# EAGLE design MT-DS v1 (EAGLE 6.1)
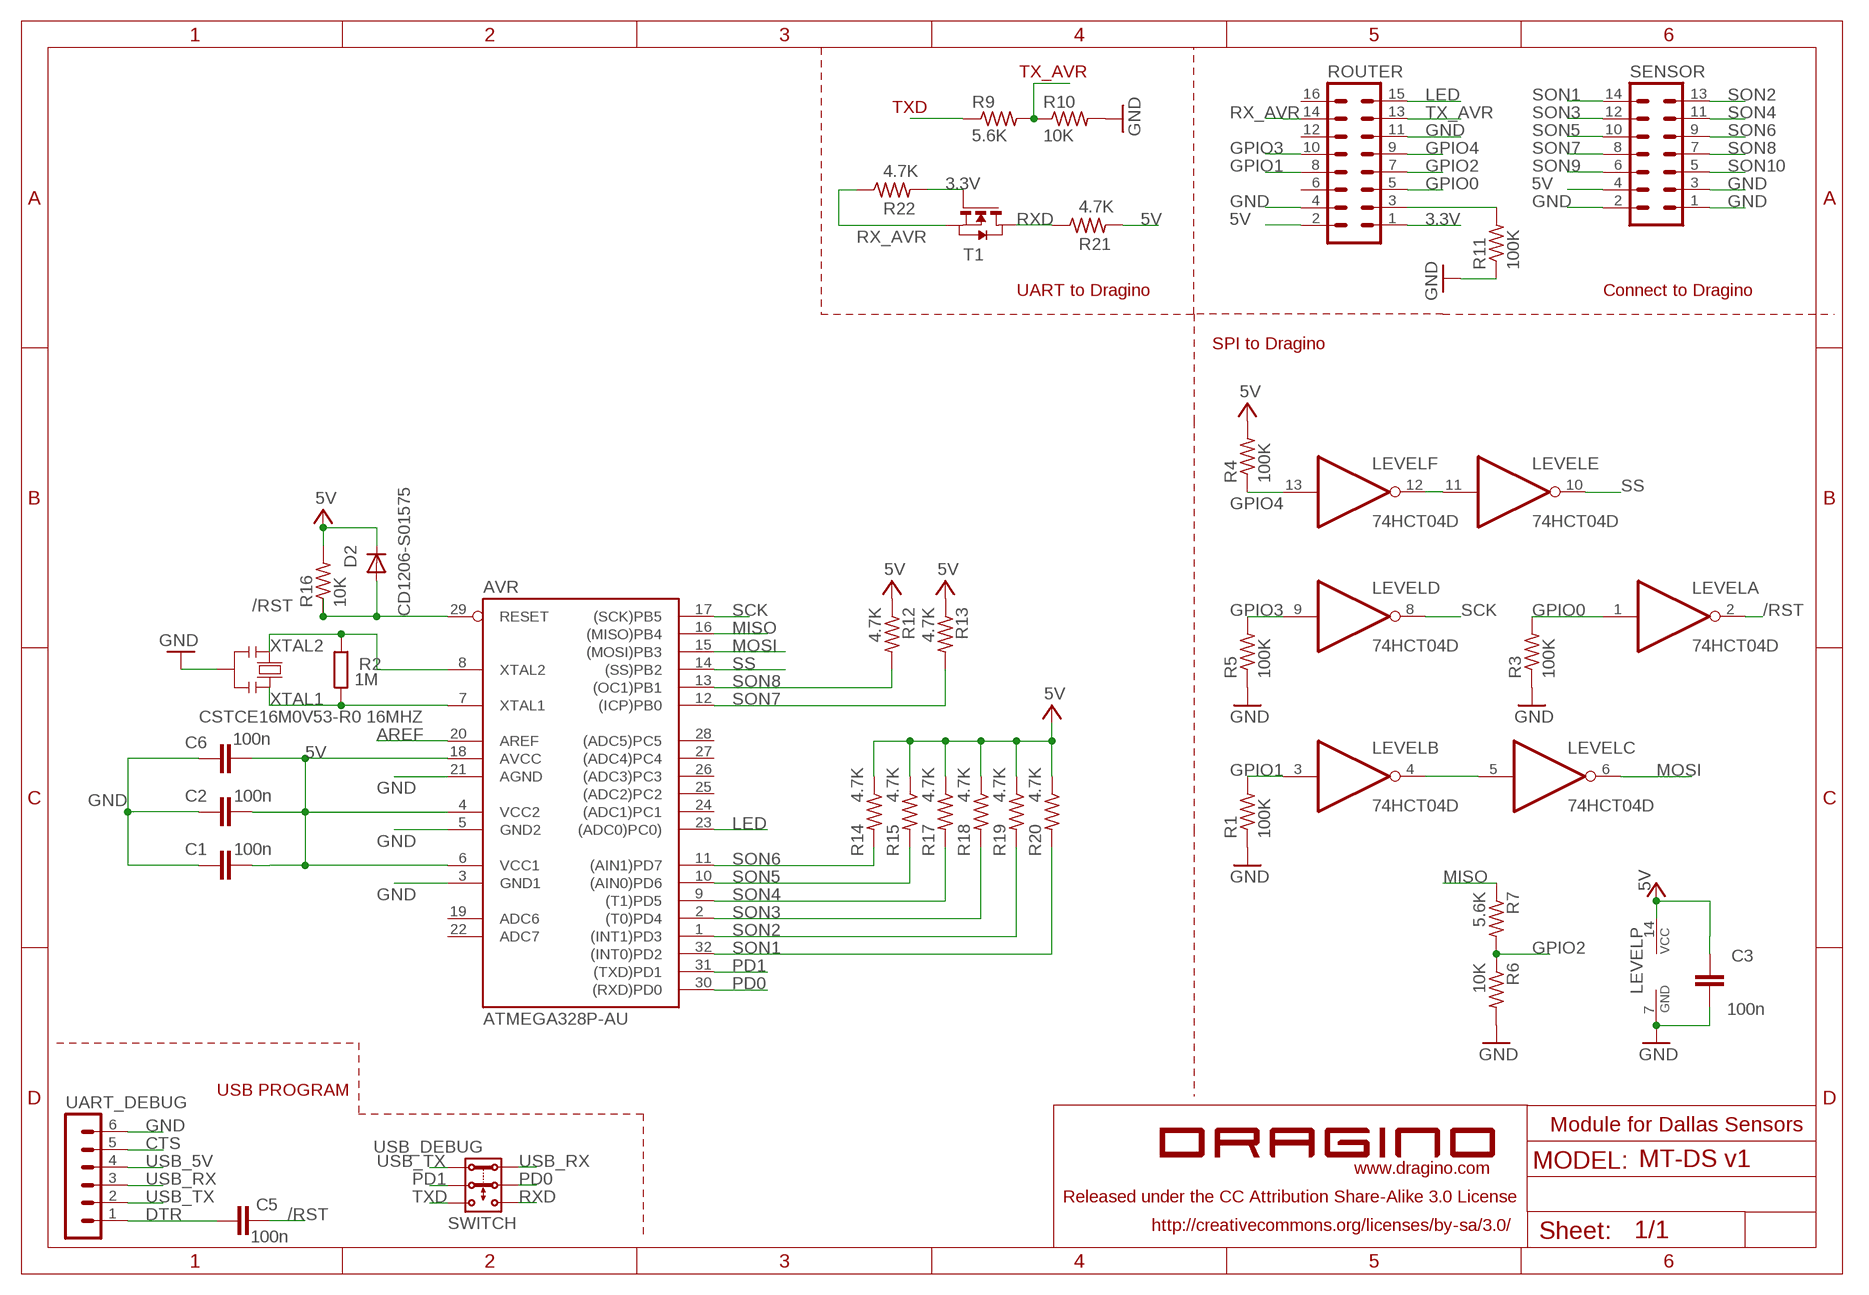
[diagram p0: schematic, sheet 1]

## Parts
AVR  ATMEGA328P-AU  SMARTPRJ_ATMEGA328P-AU  [SMARTPRJ_TQFP32-08]
C1  100n  C-EUC0402  [C0402]
C2  100n  C-EUC0402  [C0402]
C3  100n  C-EUC0402  [C0402]
C5  100n  C-EUC0402  [C0402]
C6  100n  C-EUC0402  [C0402]
D2  CD1206-S01575  DIODE-MINIMELF  [MINIMELF]
LEVEL  74HCT04D  [SO14]
R1  100K  R-US_R0402  [R0402]
R2  1M  R-EU_R0402  [R0402]
R3  100K  R-US_R0402  [R0402]
R4  100K  R-US_R0402  [R0402]
R5  100K  R-US_R0402  [R0402]
R6  10K  R-US_R0402  [R0402]
R7  5.6K  R-US_R0402  [R0402]
R9  5.6K  R-US_R0402  [R0402]
R10  10K  R-US_R0402  [R0402]
R11  100K  R-US_R0402  [R0402]
R12  4.7K  R-US_R0805  [R0805]
R13  4.7K  R-US_R0805  [R0805]
R14  4.7K  R-US_R0805  [R0805]
R15  4.7K  R-US_R0805  [R0805]
R16  10K  R-US_R0402  [R0402]
R17  4.7K  R-US_R0805  [R0805]
R18  4.7K  R-US_R0805  [R0805]
R19  4.7K  R-US_R0805  [R0805]
R20  4.7K  R-US_R0805  [R0805]
R21  4.7K  R-US_R0805  [R0805]
R22  4.7K  R-US_R0805  [R0805]
ROUTER  MA08-2  [MA08-2]
SENSOR  MA07-2  [MA07-2]
T1  NMOSFET-SOT23  [SOT-23]
U$1  LOGO-SILK  [LOGO-SILK-15MM]
UART_DEBUG  MA06-1  [MA06-1]
USB_DEBUG  SWITCH  SWITCH-2P2T  [2P2T]
Y2  CSTCE16M0V53-R0 16MHZ  RESONATORMU  [RESONATOR]

## Nets
3.3V: R22.2 ROUTER.1 T1.3(G)
5V [usbvcc]: AVR.4(VCC2) AVR.6(VCC1) AVR.18(AVCC) C1.1 C2.1 C3.2 C6.1 D2.C LEVEL.14(P:VCC) R4.2 R12.1 R13.1 R14.1 R15.1 R16.2 R17.1 R18.1 R19.1 R20.1 R21.2 ROUTER.2 SENSOR.4
/RST: AVR.29(RESET) C5.2 D2.A LEVEL.2(A:O) R16.1
AREF: AVR.20(AREF)
CTS: UART_DEBUG.5
DTR: C5.1 UART_DEBUG.1
GND [gnd]: AVR.3(GND1) AVR.5(GND2) AVR.21(AGND) C1.2 C2.2 C3.1 C6.2 LEVEL.7(P:GND) R1.1 R3.1 R5.1 R6.2 R10.2 R11.1 ROUTER.4 ROUTER.11 SENSOR.1 SENSOR.2 SENSOR.3 UART_DEBUG.6 Y2.2
GPIO0: LEVEL.1(A:I) R3.2 ROUTER.5
GPIO1: LEVEL.3(B:I) R1.2 ROUTER.8
GPIO2: R6.1 R7.2 ROUTER.7
GPIO3: LEVEL.9(D:I) R5.2 ROUTER.10
GPIO4: LEVEL.13(F:I) R4.1 ROUTER.9
LED: AVR.23((ADC0)PC0)) ROUTER.15
MISO: AVR.16((MISO)PB4) R7.1
MOSI: AVR.15((MOSI)PB3) LEVEL.6(C:O)
N$1: R11.2 ROUTER.3
N$2: LEVEL.11(E:I) LEVEL.12(F:O)
N$3: LEVEL.4(B:O) LEVEL.5(C:I)
PD0: AVR.30((RXD)PD0) USB_DEBUG.2.1
PD1: AVR.31((TXD)PD1) USB_DEBUG.2.2
RX_AVR: R22.1 ROUTER.14 T1.2(S)
RXD: R21.1 T1.1(D) USB_DEBUG.3.1
SCK: AVR.17((SCK)PB5) LEVEL.8(D:O)
SON1: AVR.32((INT0)PD2) R20.2 SENSOR.14
SON2: AVR.1((INT1)PD3) R19.2 SENSOR.13
SON3: AVR.2((T0)PD4) R18.2 SENSOR.12
SON4: AVR.9((T1)PD5) R17.2 SENSOR.11
SON5: AVR.10((AIN0)PD6) R15.2 SENSOR.10
SON6: AVR.11((AIN1)PD7) R14.2 SENSOR.9
SON7: AVR.12((ICP)PB0) R13.2 SENSOR.8
SON8: AVR.13((OC1)PB1) R12.2 SENSOR.7
SON9: SENSOR.6
SON10: SENSOR.5
SS: AVR.14((SS)PB2) LEVEL.10(E:O)
TX_AVR: R9.2 R10.1 ROUTER.13
TXD: R9.1 USB_DEBUG.3.2
USB_5V: UART_DEBUG.4
USB_RX: UART_DEBUG.3 USB_DEBUG.1.1
USB_TX: UART_DEBUG.2 USB_DEBUG.1.2
XTAL1: AVR.7(XTAL1) R2.1 Y2.3
XTAL2: AVR.8(XTAL2) R2.2 Y2.1
Unconnected: AVR.19(ADC6) AVR.22(ADC7) AVR.24((ADC1)PC1) AVR.25((ADC2)PC2) AVR.26((ADC3)PC3) AVR.27((ADC4)PC4) AVR.28((ADC5)PC5) ROUTER.6 ROUTER.12 ROUTER.16

## Notes on the sheet
- UART to Dragino | Connect to Dragino
- SPI to Dragino
- USB PROGRAM
- Module for Dallas Sensors

## Library data of the parts
AVR = dragino:SMARTPRJ_ATMEGA328P-: MICROCONTROLLER 4 Kbytes FLASH 128 bytes SRAM 256 bytes EEPROM UART 6-channel 10 bit ADC
C1-C3 C5 C6 = SmartPrj:C-EU: CAPACITOR, European symbol
D2 = diode:DIODE-: DIODE
LEVEL = 74xx-eu:74*04: Hex INVERTER
R1 R3-R7 R9-R22 = dragino:R-US_: RESISTOR, American symbol
R2 = SmartPrj:R-EU_: RESISTOR, European symbol
ROUTER = dragino:MA08-2: PIN HEADER; OC_FARNELL: unknown; OC_NEWARK: unknown
SENSOR = dragino:MA07-2: PIN HEADER; OC_FARNELL: unknown; OC_NEWARK: unknown
T1 = dragino:NMOSFET-SOT23: MOS FET; OC_FARNELL: unknown; OC_NEWARK: unknown
U$1 = dragino:LOGO-SILK: LOGO for Dragino
UART_DEBUG = dragino:MA06-1: PIN HEADER; OC_FARNELL: unknown; OC_NEWARK: unknown
USB_DEBUG = dragino:SWITCH-2P2T: SLIDE SWITCH 2P2T Part No. SS-22F05-G(A)4 Source: CANAL ELECTRONIC CO., LTD .. switsch.pdf
Y2 = SmartPrj:RESONATOR

## Net classes
0 default: width 0.254 mm, clearance 0.254 mm
1 power: width 0.61 mm, drill 0.61 mm, clearance 0.254 mm
2 gnd: width 0.305 mm, drill 0.381 mm, clearance 0.254 mm
3 usbvcc: width 0.508 mm, drill 0.61 mm, clearance 0.254 mm
4 aref: width 0.406 mm, drill 0.61 mm, clearance 0.254 mm

## Board
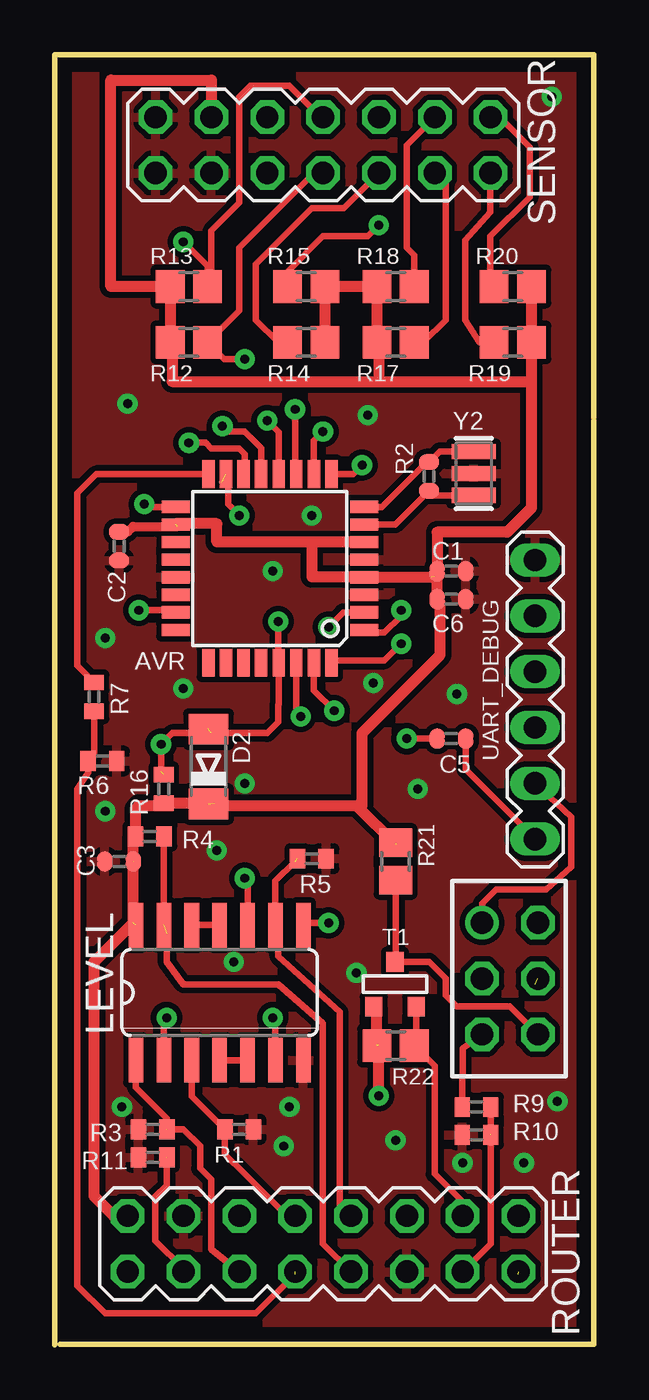
[diagram p1: board, top side]
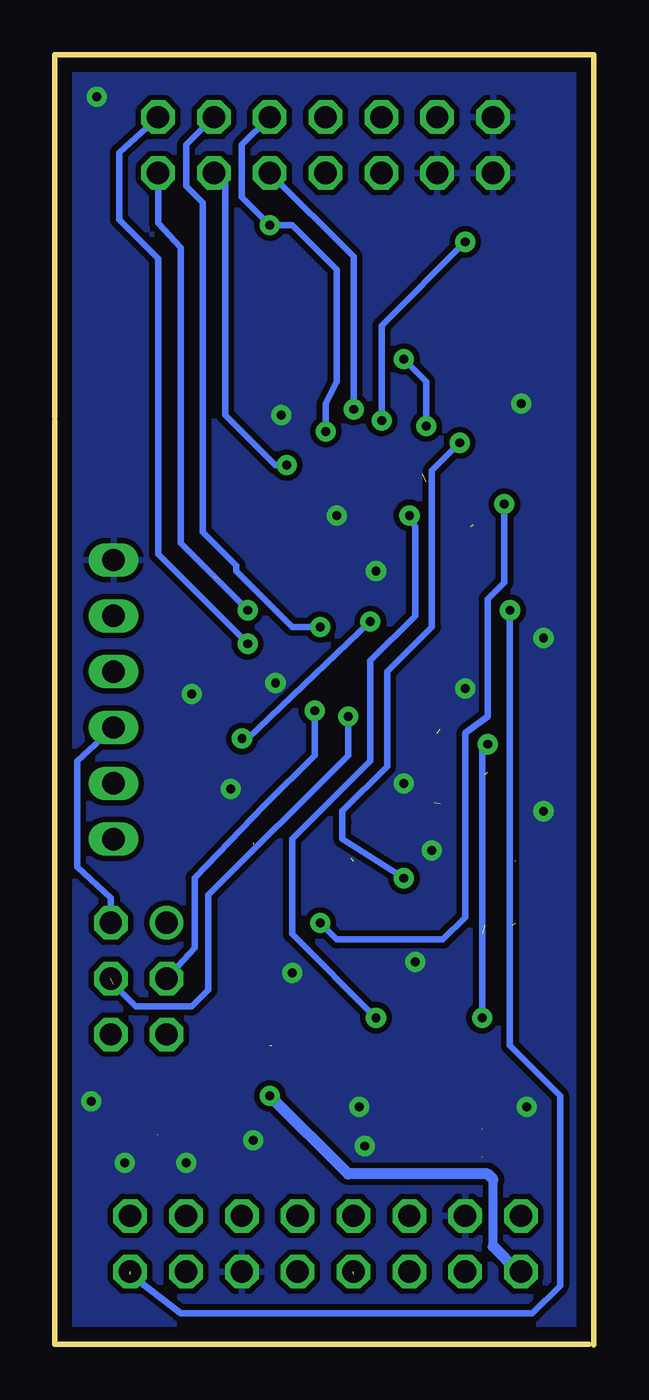
[diagram p2: board, bottom side, seen from below]

Size 24.51 x 58.69 mm. Coordinates in mm from the lower left corner, seen from the top.
Outline: 24.51,42.18 24.51,58.69 0,58.69 0,0
Outline: 24.51,42.05 24.51,0.02 0.24,0.02
Copper layers (1*16): Top 0.035mm / dielectric 1.5mm / Bottom 0.035mm
Design rules: minimum track width 5mil, minimum drill 10mil, track to track 8mil, track to pad 8mil, pad to pad 8mil, via to via 10mil, smd to smd 8mil, copper to edge 26mil, drill to drill 10mil, minimum pad ring 10mil, minimum via ring 10mil, stop-mask expansion 1mil, vias tented up to drill 30mil, thermal gap 10mil

### Footprints (pad centres in the part's own frame; a part is rotated, then mirrored left to right if it is on the bottom)
SMARTPRJ_TQFP32-08 = smd 1.27 x 0.559: 1 -4.293,2.8; 2 -4.293,2; 3 -4.293,1.2; 4 -4.293,0.4; 5 -4.293,-0.4; 6 -4.293,-1.2; 7 -4.293,-2; 8 -4.293,-2.8; 17 4.293,-2.8; 18 4.293,-2; 19 4.293,-1.2; 20 4.293,-0.4; 21 4.293,0.4; 22 4.293,1.2; 23 4.293,2; 24 4.293,2.8 | smd 0.559 x 1.27: 9 -2.8,-4.293; 10 -2,-4.293; 11 -1.2,-4.293; 12 -0.4,-4.293; 13 0.4,-4.293; 14 1.2,-4.293; 15 2,-4.293; 16 2.8,-4.293; 25 2.8,4.293; 26 2,4.293; 27 1.2,4.293; 28 0.4,4.293; 29 -0.4,4.293; 30 -1.2,4.293; 31 -2,4.293; 32 -2.8,4.293
C0402 = smd 0.7 x 0.9: 1 -0.65,0; 2 0.65,0
MINIMELF = smd 1.4 x 1.8: A 1.7,0; C -1.7,0
SO14 = smd 0.66 x 2.032: 1 -3.81,-3.073; 2 -2.54,-3.073; 3 -1.27,-3.073; 4 0,-3.073; 5 1.27,-3.073; 6 2.54,-3.073; 7 3.81,-3.073; 8 3.81,3.073; 9 2.54,3.073; 10 1.27,3.073; 11 0,3.073; 12 -1.27,3.073; 13 -2.54,3.073; 14 -3.81,3.073
R0402 = smd 0.7 x 0.9: 1 -0.65,0; 2 0.65,0
R0805 = smd 1.3 x 1.5: 1 -0.85,0; 2 0.85,0
MA08-2 = drill 1.016 octagon: 1 -8.89,-1.27; 2 -8.89,1.27; 3 -6.35,-1.27; 4 -6.35,1.27; 5 -3.81,-1.27; 6 -3.81,1.27; 7 -1.27,-1.27; 8 -1.27,1.27; 9 1.27,-1.27; 10 1.27,1.27; 11 3.81,-1.27; 12 3.81,1.27; 13 6.35,-1.27; 14 6.35,1.27; 15 8.89,-1.27; 16 8.89,1.27
MA07-2 = drill 1.016 octagon: 1 -7.62,-1.27; 2 -7.62,1.27; 3 -5.08,-1.27; 4 -5.08,1.27; 5 -2.54,-1.27; 6 -2.54,1.27; 7 0,-1.27; 8 0,1.27; 9 2.54,-1.27; 10 2.54,1.27; 11 5.08,-1.27; 12 5.08,1.27; 13 7.62,-1.27; 14 7.62,1.27
SOT-23 = smd 0.787 x 0.889: 1 0.025,-1.016; 2 -0.94,1.016; 3 0.991,1.016
MA06-1 = drill 1.016 long: 1 -6.35,0; 2 -3.81,0; 3 -1.27,0; 4 1.27,0; 5 3.81,0; 6 6.35,0
2P2T = drill 1.016 octagon: 1.1 -5.08,1.27; 2.1 -2.54,1.27; 2.2 -2.54,-1.27; 3.1 0,1.27; 3.2 0,-1.27 | drill 1.016: 1.2 -5.08,-1.27
RESONATOR = smd 0.7 x 2: 1 -1,0; 2 0,0; 3 1,0

### Placement (x,y rotation side)
AVR  9.78,35.32 180 top
C1  18.03,35.19 0 top
C2  2.92,36.34 270 top
C3  2.92,21.99 0 top
C5  18.03,27.57 180 top
C6  18.03,33.92 0 top
D2  6.98,26.3 90 top
LEVEL  7.49,16.02 0 top
R1  8.38,9.79 180 top
R2  17.02,39.51 90 top
R3  4.44,9.79 0 top
R4  4.32,23.13 180 top
R5  11.68,22.11 180 top
R6  2.16,26.56 0 top
R7  1.78,29.48 270 top
R9  19.18,10.81 0 top
R10  19.18,9.54 180 top
R11  4.44,8.52 0 top
R12  6.1,45.61 0 top
R13  6.1,48.15 0 top
R14  11.43,45.61 180 top
R15  11.43,48.15 180 top
R16  4.95,25.29 270 top
R17  15.49,45.61 0 top
R18  15.49,48.15 0 top
R19  20.83,45.61 180 top
R20  20.83,48.15 180 top
R21  15.49,21.99 90 top
R22  15.49,13.6 180 top
ROUTER  12.2,4.59 0 top
SENSOR  12.2,54.59 0 top
T1  15.49,16.4 180 top
U$1  1.14,44.21 90 top
UART_DEBUG  21.84,29.35 90 top
USB_DEBUG  20.7,14.11 270 top
Y2  19.05,39.64 270 top

### Tracks (layer width: path | path; a pad name or v marks a point on that pad's centre or on a via)
3.3V  (via drill 0.41)  (1 unrouted)
  Top 0.508: v14.73,11.32 14.73,13.6 | T1.3 14.64,15.24 R22.2 14.64,15.22 14.48,15.38
  Bottom 0.406: 4.57,4.46 4.57,7.51
  Bottom 0.508: ROUTER.1 3.43,3.32 4.57,4.46 | 4.57,7.51 4.83,7.76 11.18,7.76 v14.73,11.32
5V  (6 unrouted)
  Top 0.406: C2.1 3.32,36.99 3.56,37.23 5.59,37.23
  Top 0.508: AVR.6 11.68,36.52 | 11.68,36.52 11.68,34.94 14.07,34.94 AVR.4 17.11,34.92 C1.1 17.38,36.97 20.57,36.97 21.68,38.08 21.68,43.83 | 11.68,36.52 7.37,36.52 7.37,37.35 5.49,37.35 AVR.18 | 21.68,43.83 R19.1 R20.1 | 14.73,43.83 14.73,45.61 R17.1 R18.1 R15.1 R14.1 | 14.73,43.83 21.68,43.83 | 14.73,43.83 5.33,43.83 5.33,45.61 R12.1 R13.1 | R13.1 5.33,48.15 R13.1 | R13.1 2.54,48.15 2.54,57.55 7.12,57.55 SENSOR.4 | ROUTER.2 2.67,5.86 1.78,6.75 1.78,17.41 3.56,19.19 3.56,21.99 | C3.2 3.57,23.03 R4.2 3.67,24.38 3.81,24.53 4.84,24.53 R16.2 7.25,24.64 7.37,24.53 13.97,24.53 | 13.97,24.53 13.97,27.83 17.53,31.38 17.53,33.78 C6.1 17.38,34.83 17.27,34.94 | 13.97,24.53 13.72,24.53 15.49,22.75
/RST  (via drill 0.41)  (2 unrouted)
  Top 0.305: D2.A 7.29,28 | C5.2 v16,27.57 | v10.16,32.91 10.16,31.26 AVR.29 10.18,29.12 10.16,29.1 10.16,28.34 9.65,27.83 7.11,27.83 5.33,27.83 v4.83,27.32 4.83,26.05 5.08,25.8 | LEVEL.2 4.95,14.75 v5.08,14.87
  Bottom 0.305: v16,27.57 15.75,27.57 v10.16,32.91 | v5.08,14.87 5.08,27.07 v4.83,27.32
DTR
  Top 0.305: UART_DEBUG.1 18.68,26.16 C5.1
GND  (via drill 0.41)
  other vias: 18.54,8.27 10.67,10.81 10.41,9.03 15.49,9.29 3.05,10.81 7.37,22.49 8.13,17.41 11.68,37.73 3.3,42.81 14.48,30.11 8.64,25.54 14.22,42.31 22.61,56.78 2.29,32.15 18.29,29.61 9.91,35.19 16.51,25.29 13.72,16.91 21.34,8.27 22.86,11.06 2.29,24.27 5.84,29.86
  pour Top: 0,58.56 23.88,58.56 23.88,37.23 24.13,21.48 24.13,16.14 24.13,-0.62 0,-0.62
  pour Bottom: 0.25,58.56 0.25,-0.62 24.13,-0.62 24.13,16.14 23.88,42.31 23.88,58.82 0.25,58.82
GPIO0  (1 unrouted)
  Top 0.305: LEVEL.1 3.68,11.7 4.32,11.06 5.08,10.3 R3.2 | R3.2 5.08,9.54 R3.2 | R3.2 5.84,9.79 6.6,9.03 6.6,8.02 7.11,7.51 7.11,4.34 ROUTER.5
GPIO1
  Top 0.305: LEVEL.3 6.22,11.3 R1.2 7.73,8.67 8.64,7.76 10.54,5.86 ROUTER.8
GPIO2  (1 unrouted)
  Top 0.305: 10.92,3.19 9.14,1.41 2.29,1.41 1.02,2.68 1.02,25.29 1.51,26.04 R6.1 1.78,26.83 R7.2
GPIO3  (1 unrouted)
  Top 0.305: ROUTER.10 12.96,6.23 12.95,12.59 12.95,15.13 10.16,17.67 10.16,18.96 LEVEL.9 10.03,21.1 10.92,21.99
GPIO4  (1 unrouted)
  Top 0.305: ROUTER.9 12.19,4.6 12.19,14.62 10.16,16.4 5.84,16.4 5.08,17.41 5.08,18.68 | LEVEL.13 4.95,23.11 R4.1
LED  (via drill 0.41)  (1 unrouted)
  Top 0.305: AVR.23 5.49,33.42 v3.81,33.42
  Bottom 0.305: v3.81,33.42 3.81,13.6 1.52,11.32 1.52,2.68 2.79,1.41 18.8,1.41 21.08,3.19
MISO
  Top 0.305: AVR.16 1.88,39.61 1.02,38.75 1.02,30.89 R7.1
MOSI  (via drill 0.41)  (1 unrouted)
  Top 0.305: LEVEL.6 10.03,14.75 v9.91,14.87 | v8.38,37.73 7.87,38.24 7.87,39 7.62,39.26
  Bottom 0.305: v9.91,14.87 13.72,18.68 13.72,23 10.16,26.56 10.16,31.13 8.13,33.16 8.13,37.23 v8.38,37.73
N$1  (1 unrouted)
  Top 0.305: ROUTER.3 5.85,3.44 4.57,4.71 4.57,6.75 5.08,7.25 R11.2
N$2
  Top 0.305: LEVEL.12 LEVEL.11
N$3
  Top 0.305: LEVEL.5 LEVEL.4
PD0  (via drill 0.41)  (1 unrouted)
  Top 0.305: AVR.30 10.98,28.79 v11.18,28.59
  Bottom 0.305: v11.18,28.59 11.18,26.81 17.53,20.46 17.53,16.14 18.29,15.38 20.32,15.38 20.83,15.38 21.84,16.4
PD1  (via drill 0.41)
  Top 0.305: AVR.31 11.78,29.77 v12.7,28.84
  Bottom 0.305: v12.7,28.84 12.7,26.81 14.99,24.53 18.16,21.22 18.16,18.05 USB_DEBUG.2.2
RX_AVR
  Top 0.305: T1.2 16.43,13.69 R22.1 17.27,12.68 17.27,7.76 18.55,6.48 ROUTER.14
RXD
  Top 0.305: T1.1 15.49,17.41 | 15.49,17.41 17.02,17.41 17.78,16.65 17.78,15.89 18.29,15.38 20.7,15.38 USB_DEBUG.3.1 | R21.1 15.49,17.41
SCK  (via drill 0.41)
  Top 0.305: AVR.17 4.18,38.12 v4.06,38.24 | v12.45,19.19 11.41,19.19 LEVEL.8
  Bottom 0.305: v4.06,38.24 4.06,34.69 4.83,33.92 4.83,28.59 5.84,27.83 5.84,19.45 6.86,18.43 11.68,18.43 v12.45,19.19
SON1  (via drill 0.41)
  Top 0.305: AVR.32 12.68,31.13 14.99,31.13 v15.75,31.89 | SENSOR.14 20.23,55.86 21.59,54.5 21.59,52.21 19.81,50.43 19.81,48.24 R20.2
  Bottom 0.305: v15.75,31.89 19.82,35.96 19.81,49.42 21.59,51.2 21.59,54.24 SENSOR.14
SON2  (via drill 0.41)
  Top 0.305: AVR.1 14.19,32.4 14.99,32.4 15.75,33.16 v15.75,33.42 | R19.2 19.3,45.61 18.67,46.62 18.67,50.26 19.81,51.53 19.81,51.96 SENSOR.13
  Bottom 0.305: v15.75,33.42 18.8,36.46 18.8,49.93 19.81,51.02 SENSOR.13
SON3  (via drill 0.41)
  Top 0.305: AVR.2 13.11,33.32 v12.45,32.65 | R18.2 16.34,49.58 16,49.93 16,54.58 SENSOR.12
  Bottom 0.305: v12.45,32.65 13.72,32.65 16.26,35.19 16.26,35.45 17.78,36.97 17.78,51.96 18.54,52.72 18.54,54.6 SENSOR.12
SON4  (via drill 0.41)
  Top 0.305: R17.2 16.76,45.61 17.78,46.62 17.78,52.82 SENSOR.11 | AVR.9 13.56,39.61 v13.97,40.02
  Bottom 0.305: v13.97,40.02 14.48,40.02 16.76,42.31 16.76,52.8 SENSOR.11
SON5  (via drill 0.41)
  Top 0.305: AVR.10 11.78,41.13 v12.19,41.54 | R15.2 10.58,48.82 12.19,50.43 13.21,50.43 14.22,50.43 v14.73,50.94
  Bottom 0.305: v12.19,41.54 12.19,42.81 11.68,43.83 11.68,48.91 13.72,50.94 v14.73,50.94 16,52.21 16,54.6 SENSOR.10
SON6  (via drill 0.41)
  Top 0.305: R14.2 10.16,45.61 9.14,46.62 9.14,49.16 11.68,51.7 13.13,51.7 SENSOR.9 | AVR.11 10.92,39.67 10.92,42.05 v10.92,42.56
  Bottom 0.305: v10.92,42.56 10.92,49.5 SENSOR.9
SON7  (via drill 0.41)
  Top 0.305: SENSOR.8 12.1,55.86 10.67,57.29 8.89,57.29 8.38,56.78 8.38,51.96 7.11,50.69 7.11,48.31 R13.2 6.95,49.08 v5.84,50.18 | AVR.12 10.18,41.53 v9.65,42.05
  Bottom 0.305: v9.65,42.05 9.65,46.37 v5.84,50.18
SON8  (via drill 0.41)
  Top 0.305: SENSOR.7 11.77,53.32 8.38,49.93 8.38,47.04 R12.2 7.71,44.85 v8.64,44.85 | AVR.13 9.38,40.8 8.64,41.54 7.87,41.54 v7.62,41.8
  Bottom 0.305: v7.62,41.8 7.62,43.83 v8.64,44.85
SS  (via drill 0.41)
  Top 0.305: LEVEL.10 8.76,21.1 v8.64,21.22 | v6.1,41.04 6.86,41.04 7.11,40.78 8.38,40.78 8.64,40.53 8.64,39.56 AVR.14
  Bottom 0.305: v8.64,21.22 11.43,23 11.43,23.76 11.43,24.27 9.4,26.3 9.4,28.34 9.4,30.62 7.37,32.65 7.37,39.77 v6.1,41.04
TX_AVR  (1 unrouted)
  Top 0.305: R10.1 19.83,4.59 ROUTER.13 | R9.2 19.83,9.56 19.81,9.54
TXD
  Top 0.305: R9.1 18.54,13.48 USB_DEBUG.3.2
USB_RX
  Bottom 0.305: USB_DEBUG.1.1 21.97,20.34 23.49,21.73 23.49,26.56 UART_DEBUG.3
USB_TX
  Top 0.305: USB_DEBUG.1.2 19.43,20.08 20.07,20.72 22.35,20.72 23.49,21.73 23.49,24.02 UART_DEBUG.2
XTAL1
  Top 0.305: Y2.3 17.24,38.64 R2.1 15.48,37.32 AVR.7
XTAL2
  Top 0.305: Y2.1 17.49,40.64 R2.2 17.02,40.27 14.86,38.12 AVR.8

### Text on the board
bNames: designed by | MADE IN | tinker it | ITALY | ATMEGA328
tDocu: GND | 5V | SON9 | SON7 | SON5 | SON3 | SON1 | GND | GND | SON10 | SON8 | SON6 | SON4 | SON2 | MODEL: MT-DS-P V1.0 | GND | N/A | N/A | RX | TX | ON | DTR | DEBUG | Temperature Processing Module
214bmp: D:/SmartProjects/Snc/a4_bn_logo2.bmp